# Altium schematic sheet ESC.SchDoc
size A4
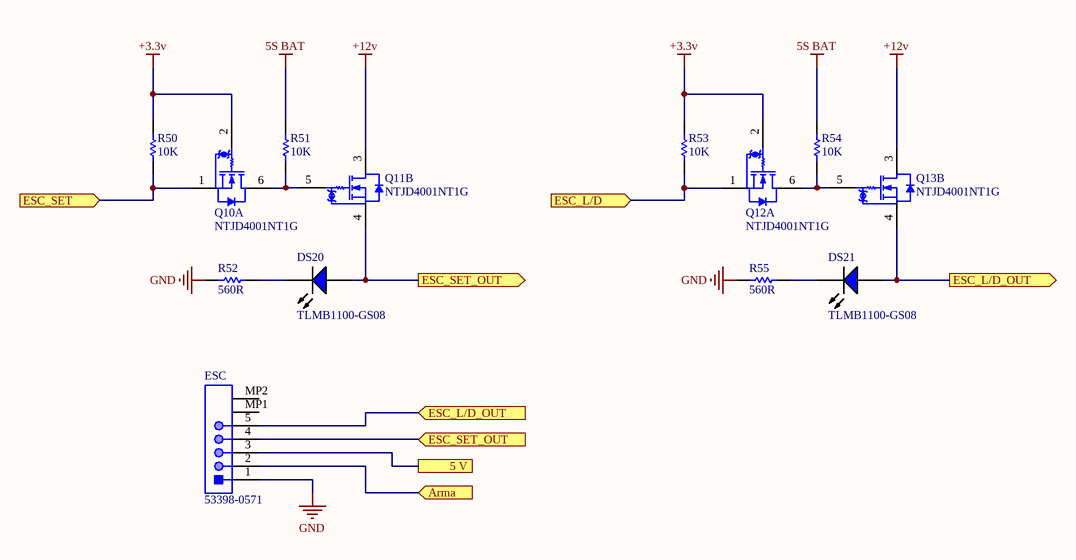
[diagram p0: ESC.SchDoc]

## Parts
DS20  TLMB1100-GS08  [VISH-TLMX1100-2_V]
DS21  TLMB1100-GS08  [VISH-TLMX1100-2_V]
ESC  53398-0571  [MOLX-53398-0571-5_V]
Q10  NTJD4001NT1G  [ONSC-SOT-363-6-419B-02_W_V]  (part A of 2)
Q11  NTJD4001NT1G  [ONSC-SOT-363-6-419B-02_W_V]  (part B of 2)
Q12  NTJD4001NT1G  [ONSC-SOT-363-6-419B-02_W_V]  (part A of 2)
Q13  NTJD4001NT1G  [ONSC-SOT-363-6-419B-02_W_V]  (part B of 2)
R50  value 10K  [RES-0402]  (hidden comment: CRCW040210K0FKEDC)
R51  value 10K  [RES-0402]  (hidden comment: CRCW040210K0FKEDC)
R52  value 560R  [RES-0402]  (hidden comment: RR0510P-561-D)
R53  value 10K  [RES-0402]  (hidden comment: CRCW040210K0FKEDC)
R54  value 10K  [RES-0402]  (hidden comment: CRCW040210K0FKEDC)
R55  value 560R  [RES-0402]  (hidden comment: RR0510P-561-D)

## Ports
5 V, Arma (in), ESC_L/D (in), ESC_L/D_OUT (in), ESC_L/D_OUT (out), ESC_SET (in), ESC_SET_OUT (in), ESC_SET_OUT (out)

## Nets
5S BAT: R51.2 R54.2
+3.3v: Q10.2(G1) Q12.2(G1) R50.2 R53.2
+12v: Q11.3(D2) Q13.3(D2)
GND: ESC.1 R52.1 R55.1
5 V: ESC.3 ; port 5 V
Arma: ESC.2 ; port Arma
ESC_L/D: Q12.1(S1) R53.1 ; port ESC_L/D
ESC_L/D_OUT: DS21.1(A) ESC.5 Q13.4(S2) ; port ESC_L/D_OUT
ESC_SET: Q10.1(S1) R50.1 ; port ESC_SET
ESC_SET_OUT: DS20.1(A) ESC.4 Q11.4(S2) ; port ESC_SET_OUT
NetDS20_2: DS20.2(K) R52.2
NetDS21_2: DS21.2(K) R55.2
NetQ10_6: Q10.6(D1) Q11.5(G2) R51.1
NetQ12_6: Q12.6(D1) Q13.5(G2) R54.1

Not connected (* = marked no-connect by the designer): ESC MP1 MP2

## Library data of the parts
DS20 DS21 = CMP-1666-00028-1: Blue LED, 15 mA, 3.9 V, -40 to 100 degC, 2-Pin SMD (0603), RoHS, Tape and Reel / (https://br.mouser.com/datasheet/2/427/tlmb1100-279843.pdf); Tolerance: 10%; Voltage Rating: 100 V; Capacitance: 10 nF; Type (Capacitors): X7R; Case\Package: Radial; ComponentLink1Description: Manufacturer URL; REACH SVHC: No SVHC; Package Quantity: 500; PackageDescription: 2-Pin Surface Mount Device, Body 1.6 x 0.8 mm; Pins: 2; ComponentLink2URL: http://download.siliconexpert.com/pdfs/2016/8/7/12/43/26/667/vsh_/manual/379263299541529tlmb1100.pdf; RoHSCompliant: true; Lead Pitch: 2.54 mm; Height: 2.54 mm; DatasheetVersion: Rev. 2.7, 03/2016; Length: 5.33 mm; ComponentLink1URL: http://www.vishay.com/; Min Operating Temperature: -55 degC; PackageReference: 0603; Packaging: Bulk; ComponentLink2Description: Datasheet; Max Operating Temperature: 125 degC; Radiation Hardening: No; Width: 3.81 mm; Mount: Through Hole
ESC = CMP-2000-05250-1: Brand: Molex; Number of Positions: 5Position; Mounting Angle: Vertical; Current Rating: 1A; Pitch: 1.25mm; Voltage Rating: 125V; Type: Shrouded; Tradename: PicoBlade; Datasheet Version: Rev. E, 04/2006; Housing Material: Nylon; Datasheet URL: http://www.molex.com/pdm_docs/sd/533980571_sd.pdf; Termination Style: SMD; Contact Gender: Pin(Male); Factory Pack Quantity: 1000; Number of Rows: 1Row; Product: Headers; Package Reference: MOLX-53398-0571-5; Contact Material: PhosphorBronze; RoHS: Details; Manufacturer URL: http://www.molex.com/; Product Category: Headers&WireHousings; Contact Plating: Tin; Manufacturer: Molex; Series: 53398; Packaging: Reel; Mounting Style: SMD
Q10-Q13 = CMP-1058-00809-1: Small Signal MOSFET 30 V, 250 mA, Dual N-Channel, 6-Pin SOT-363, Pb-Free, Tape and Reel / https://www.mouser.com/ProductDetail/ON-Semiconductor/NTJD4001NT1G?qs=%2fha2pyFadugvj01pj2A09QHzF4R5JD3PDyNq%2fIBdLXOX%2fuvmG9BAjA%3d%3d; Manufacturer: On Semiconductor; Crss Typ (pF): 7.25; Channel Polarity: N Channel; Coss Typ (pF): 19; V(BR)DSS Min (V): 30; VGS(th) Max (V): 1.5; PD Max (W): 0.272; VGS Max (V): 20; ID Max (A): 0.25; PackageVersion: Rev. W, 01/2006; ComponentLink3URL: http://www.onsemi.com/pub_link/Collateral/NTJD4001N-D.PDF; RoHS: Pb-Free; Mounting Technology: Surface Mount; ComponentLink1Description: Manufacturer URL; Packing: Tape and Reel; ComponentLink2URL: http://www.onsemi.com/pub_link/Collateral/NTJD4001N-D.PDF; ComponentLink2Description: Datasheet; PartNumber: NTJD4001NT1G; DatasheetVersion: Rev. 6; ComponentLink1URL: http://www.onsemi.com/; Configuration: Dual; PackageDescription: 6-Pin Small Outline Transistor, Body 2 x 1.25 mm, Pitch 0.65 mm; PackageReference: SOT-363-6-419B-02_W; Ciss Typ (pF): 20; ComponentLink3Description: Package Specification; Package Type: SC-88-6 / SC-70-6 / SOT-363-6; PartId: 1
R50 R51 R53 R54 = RES 1K 0402: RES SMD 10K OHM 1% 1/16W 0402 / https://www.mouser.com/ProductDetail/Vishay/CRCW040210K0FKEDC?qs=sGAEpiMZZMu61qfTUdNhG9bvwnXh9sSrBLX2lJMdqZocCF4HyDSLVA%3d%3d
R52 R55 = RES 1K 0402: RES SMD 560R OHM 0.5% 1/16W 0402 / https://www.mouser.com/ProductDetail/Vishay/CRCW0402560RFKEDC?qs=sGAEpiMZZMu61qfTUdNhG9bvwnXh9sSraxDhR00SYM54dmU%2f%252bVaaOg%3d%3d